# EAGLE design BlaszczakPI (EAGLE 7.7.0)
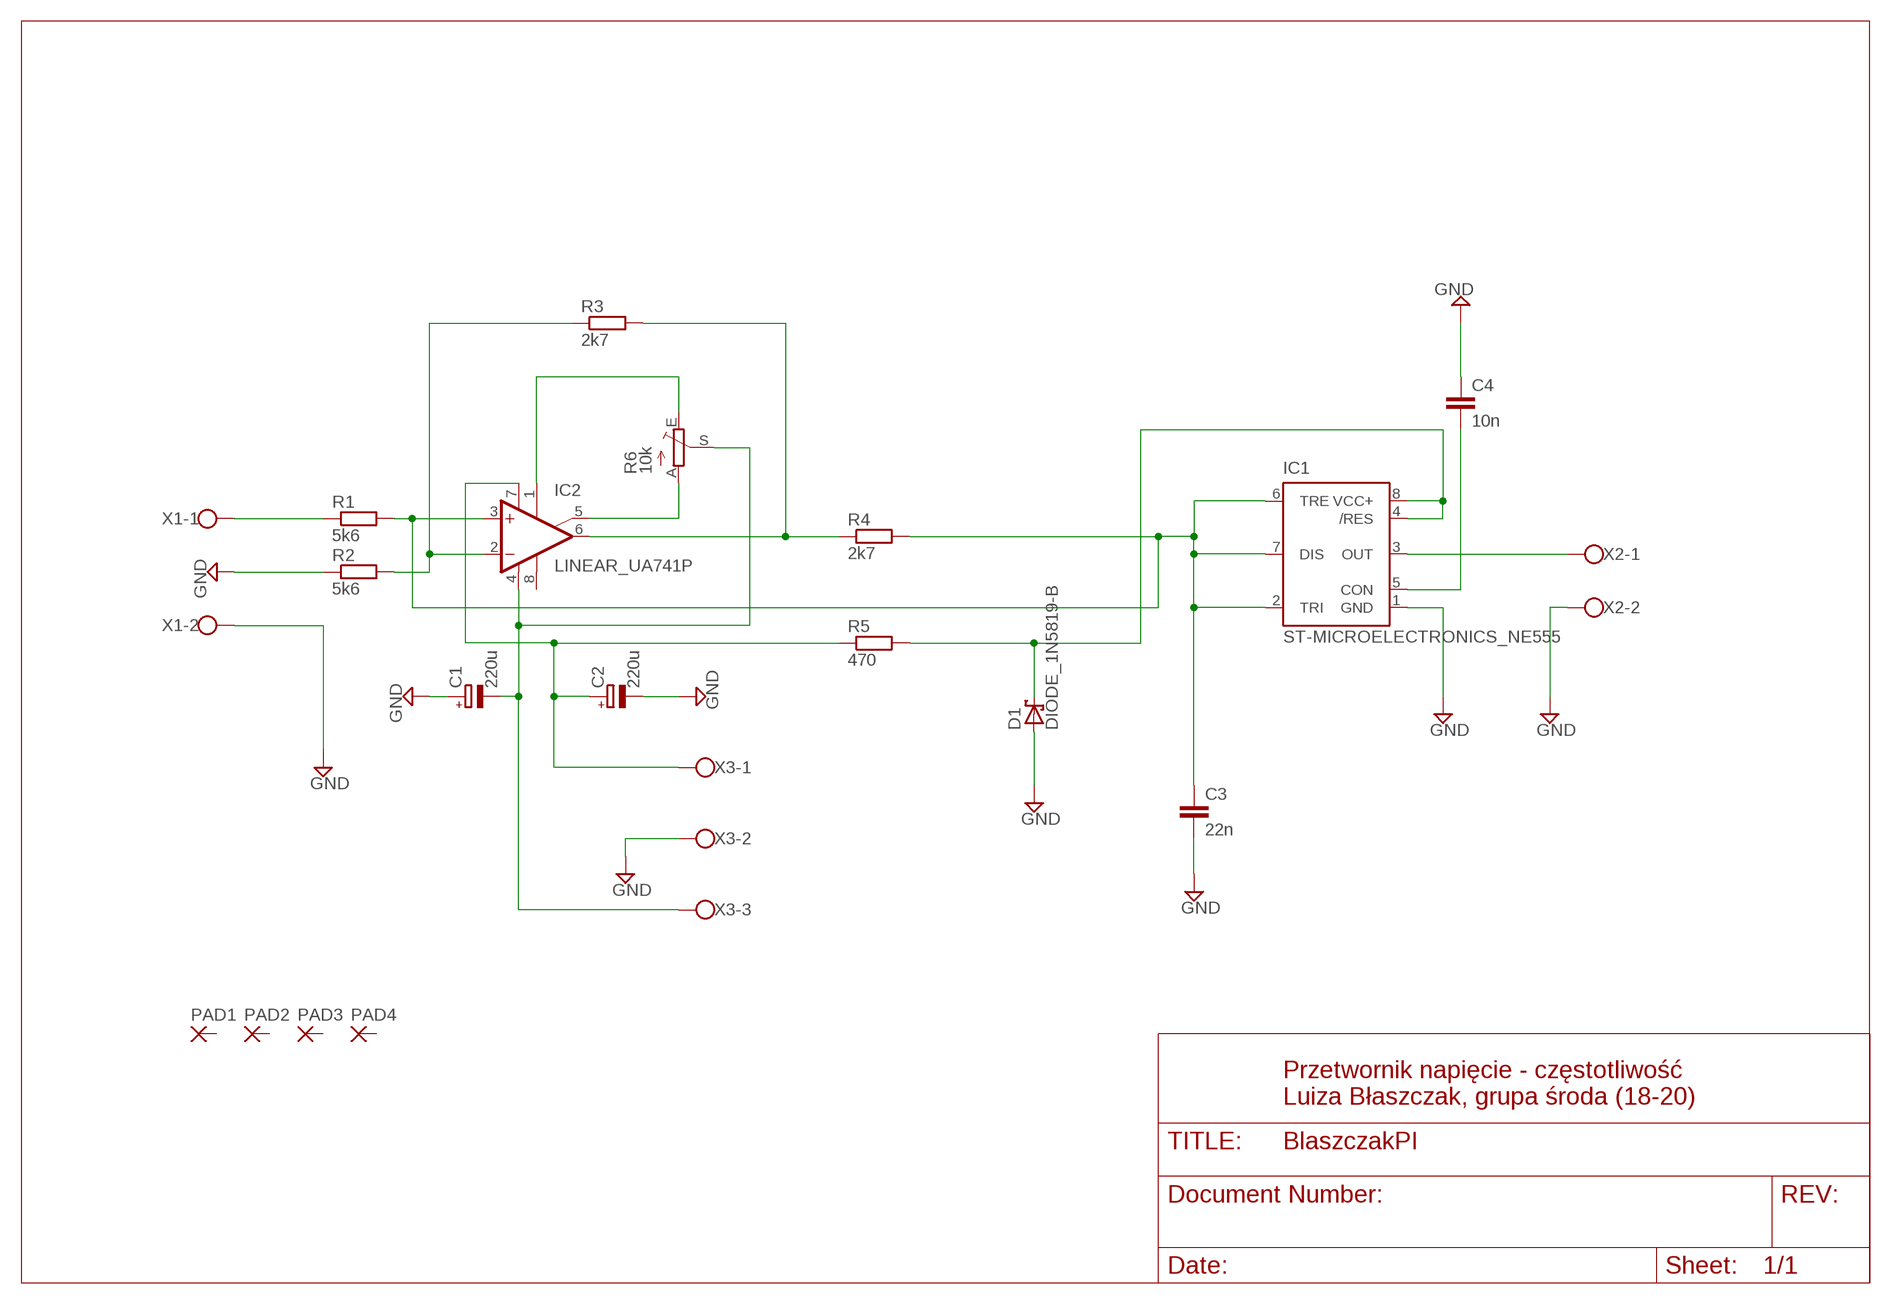
[diagram p0: schematic, sheet 1]

## Parts
C1  220u  RCL_CPOL-EUE2.5-7  [RCL_E2,5-7]
C2  220u  RCL_CPOL-EUE2.5-7  [RCL_E2,5-7]
C3  22n  C-EUC1206  [C1206]
C4  10n  C-EUC1206  [C1206]
D1  DIODE_1N5819-B  [DIODE_DO41-7.6]
IC1  ST-MICROELECTRONICS_NE555  [ST-MICROELECTRONICS_DIL-08]
IC2  LINEAR_UA741P  [LINEAR_DIL08]
PAD1  2,54/1,1  [2,54/1,1]
PAD2  2,54/1,1  [2,54/1,1]
PAD3  2,54/1,1  [2,54/1,1]
PAD4  2,54/1,1  [2,54/1,1]
R1  5k6  R-EU_M1206  [M1206]
R2  5k6  R-EU_M1206  [M1206]
R3  2k7  R-EU_M1206  [M1206]
R4  2k7  R-EU_M1206  [M1206]
R5  470  R-EU_M1206  [M1206]
R6  10k  POT_TRIM_EU-CA6V  [POT_CA6V]
X1  CON-WAGO-500_W237-102  [CON-WAGO-500_W237-102]
X2  CON-WAGO-500_W237-102  [CON-WAGO-500_W237-102]
X3  CON-WAGO-500_W237-103  [CON-WAGO-500_W237-103]

## Nets
GND: C1.+ C2.- C3.2 C4.1 D1.A IC1.1(GND) R2.1 X1.2 X2.2 X3.2
N$1: R1.1 X1.1
N$3: IC2.2(-IN) R2.2 R3.1
N$4: C1.- IC2.4(V-) R6.S X3.3
N$5: C2.+ IC2.7(V+) R5.1 X3.1
N$6: IC2.1(ON1) R6.E
N$7: IC2.5(ON2) R6.A
N$8: IC2.6(OUT) R3.2 R4.1
N$9: D1.C IC1.4(/RES) IC1.8(VCC+) R5.2
N$11: C4.2 IC1.5(CON)
N$12: IC1.3(OUT) X2.1
R80: C3.1 IC1.2(TRI) IC1.6(TRE) IC1.7(DIS) IC2.3(+IN) R1.2 R4.2
Unconnected: IC2.8(OPT) PAD1.1(P) PAD2.1(P) PAD3.1(P) PAD4.1(P)

## Notes on the sheet
- Przetwornik napięcie - częstotliwość 
  Luiza Błaszczak, grupa środa (18-20)

## Library data of the parts
C1 C2 = Blaszczak:RCL_CPOL-EU: POLARIZED CAPACITOR, European symbol
C3 C4 = rcl:C-EU: CAPACITOR, European symbol
D1 = Blaszczak:DIODE_1N581*: 1.0A SCHOTTKY BARRIER RECTIFIER Source: http://www.diodes.com/datasheets/ds23001.pdf
IC1 = Blaszczak:ST-MICROELECTRONICS_NE555: General purpose bipolar Timer; MF: Arrow Electronics; MPN: NE555N; OC_FARNELL: 1467742; OC_NEWARK: 89K1486
IC2 = Blaszczak:LINEAR_*741: OP AMP
PAD1-PAD4 = wirepad:2,54/1,1: THROUGH-HOLE PAD
R1-R5 = rcl:R-EU_: RESISTOR, European symbol
R6 = Blaszczak:POT_TRIM_EU-: POTENTIOMETER
X1 X2 = Blaszczak:CON-WAGO-500_W237-102: WAGO SCREW CLAMP; MPN: 237-102; OC_FARNELL: unknown; OC_NEWARK: 70K9898
X3 = Blaszczak:CON-WAGO-500_W237-103: WAGO SCREW CLAMP; MPN: 237-103; OC_FARNELL: unknown; OC_NEWARK: 18M7116

## Board
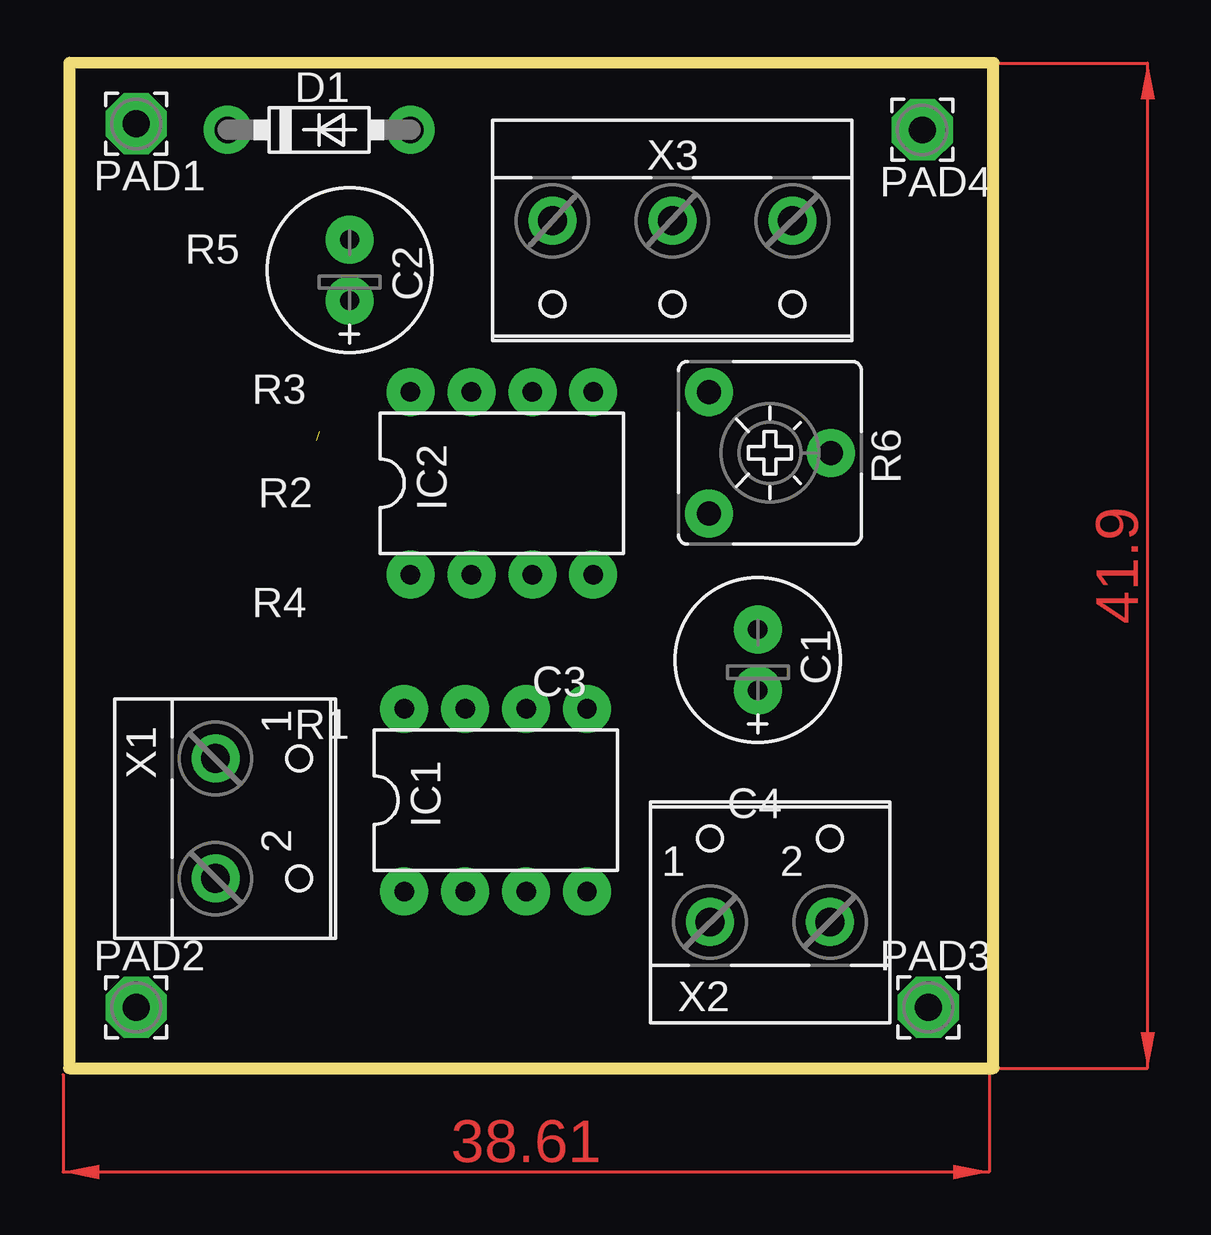
[diagram p1: board, top side]
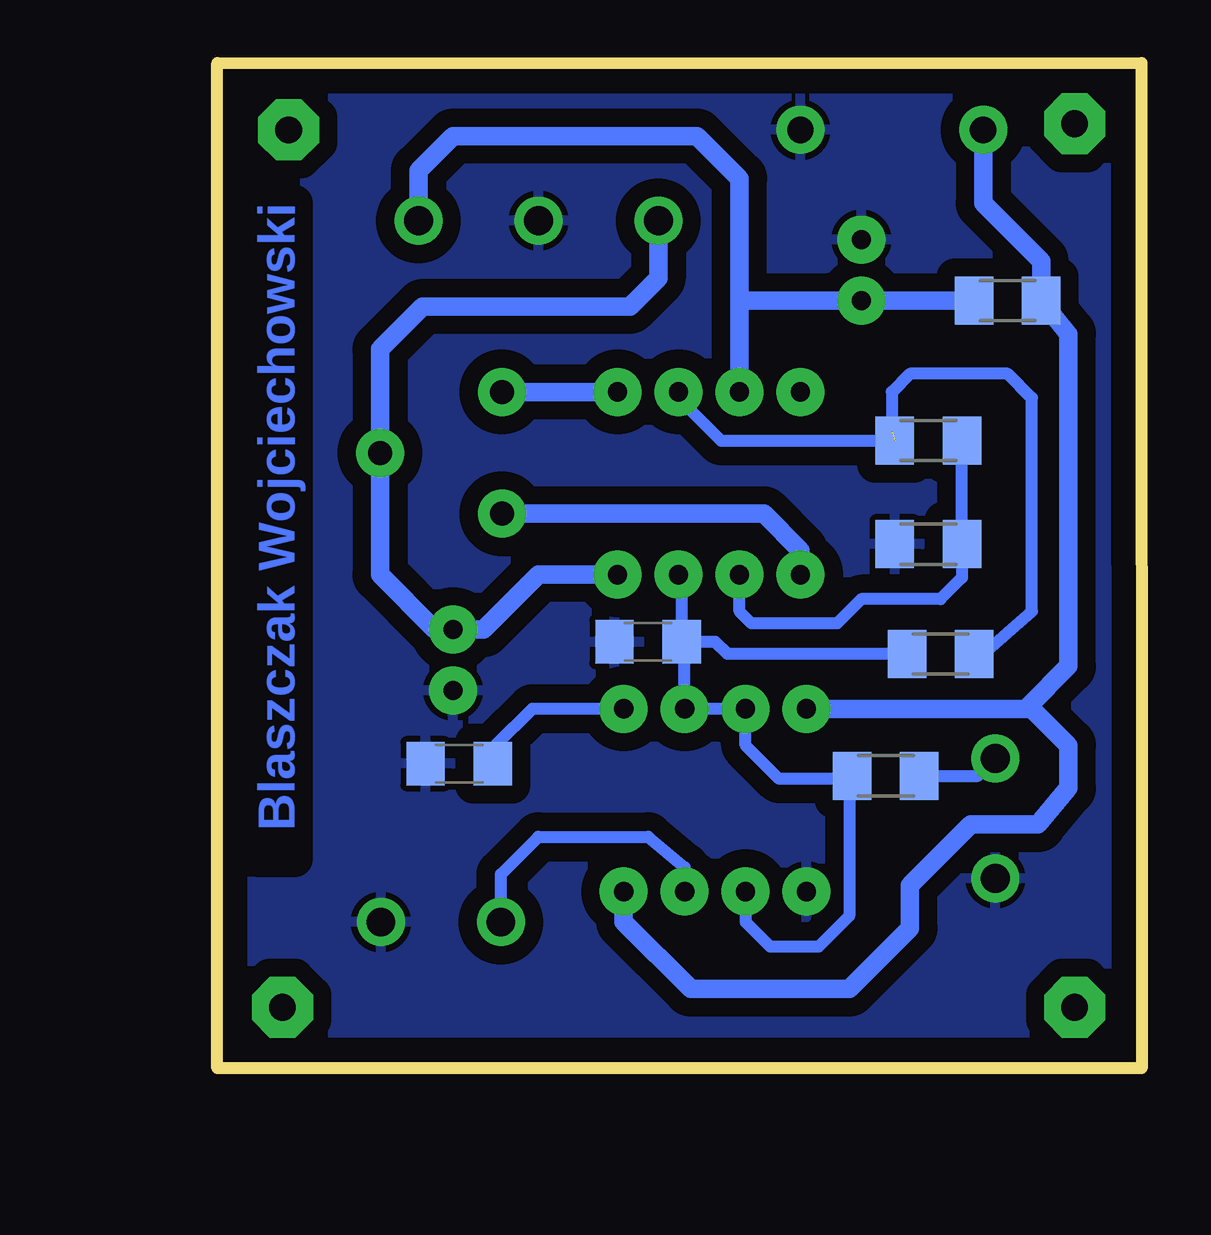
[diagram p2: board, bottom side, seen from below]

Size 38.53 x 41.91 mm. Coordinates in mm from the lower left corner, seen from the top.
Outline: 0,0 38.53,0 38.53,41.9 0.01,41.91 0,0
Copper layers (1*16): Top 0.035mm / dielectric 1.5mm / Bottom 0.035mm
Design rules "default": minimum track width 10mil, minimum drill 24mil, track to track 8mil, track to pad 8mil, pad to pad 8mil, via to via 8mil, smd to smd 8mil, copper to edge 40mil, drill to drill 8mil, minimum pad ring 10mil, minimum via ring 8mil, stop-mask expansion 4mil, vias tented up to drill 0mil, thermal gap 10mil

### Footprints (pad centres in the part's own frame; a part is rotated, then mirrored left to right if it is on the bottom)
RCL_E2,5-7 = drill 0.8 pad 2: + -1.27,0; - 1.27,0
C1206 = smd 1.6 x 1.8: 1 -1.4,0; 2 1.4,0
DIODE_DO41-7.6 = drill 1.1 pad 2: A 3.81,0; C -3.81,0
ST-MICROELECTRONICS_DIL-08 = drill 0.8 pad 2: 1 -3.81,-3.81; 2 -1.27,-3.81; 3 1.27,-3.81; 4 3.81,-3.81; 5 3.81,3.81; 6 1.27,3.81; 7 -1.27,3.81; 8 -3.81,3.81
LINEAR_DIL08 = drill 0.8 pad 2: 1 -3.81,-3.81; 2 -1.27,-3.81; 3 1.27,-3.81; 4 3.81,-3.81; 5 3.81,3.81; 6 1.27,3.81; 7 -1.27,3.81; 8 -3.81,3.81
2,54/1,1 = drill 1.118 pad 2.54 octagon: 1 0,0
M1206 = smd 1.6 x 2: 1 -1.4,0; 2 1.4,0
POT_CA6V = drill 1 pad 2: A -2.54,-2.54; E 2.54,-2.54; S 0,2.54
CON-WAGO-500_W237-102 = drill 1.2 pad 2: 1 -2.5,-1.27; 2 2.5,-1.27
CON-WAGO-500_W237-103 = drill 1.2 pad 2: 1 -5,-1.29; 2 0,-1.29; 3 5,-1.29

### Placement (x,y rotation side)
C1  28.7,17.02 90 top
C2  11.68,33.27 90 top
C3  20.57,17.78 180 bottom
C4  28.45,12.7 0 bottom
D1  10.41,39.12 0 top
IC1  17.78,11.18 0 top
IC2  18.03,24.38 0 top
PAD1  2.79,39.37 0 top
PAD2  2.79,2.54 0 top
PAD3  35.81,2.54 0 top
PAD4  35.56,39.12 0 top
R1  10.67,12.19 180 bottom
R2  8.89,21.84 0 bottom
R3  8.89,26.16 180 bottom
R4  8.38,17.27 180 bottom
R5  5.59,32 0 bottom
R6  29.21,25.65 270 top
X1  7.37,10.41 270 top
X2  29.21,7.37 0 top
X3  25.15,34.04 180 top

### Tracks (layer width: path | path; a pad name or v marks a point on that pad's centre or on a via)
GND
  pour Bottom (isolate 0.762): -0.25,-0.25 38.35,-0.25 38.35,41.66 -0.25,41.91
N$1
  Bottom 0.508: R1.1 6.82,12.19 X1.1
N$3
  Bottom 0.508: R3.1 R2.2 7.49,20.45 8.38,19.56 11.68,19.56 12.7,18.54 16.26,18.54 16.76,19.05 IC2.2
N$4
  Bottom 0.762: IC2.4 25.15,20.57 27.43,18.29 C1.- 29.46,18.29 31.75,20.57 R6.S 31.75,29.97 29.97,31.75 21.34,31.75 20.15,32.94 X3.3
N$5
  Bottom 0.762: IC2.7 16.76,32 | 16.76,32 16.76,37.08 18.54,38.86 28.7,38.86 30.15,37.42 X3.1 | 16.76,32 12.95,32 C2.+ R5.1
N$6
  Bottom 0.762: IC2.1 14.22,21.59 15.75,23.11 R6.E
N$7
  Bottom 0.762: IC2.5 R6.A
N$8  (1 unrouted)
  Bottom 0.508: R4.1 6.6,17.27 4.57,19.05 4.57,27.94 5.59,28.96 9.65,28.96 10.41,28.19 10.41,26.54 | R3.2 17.53,26.16 19.3,27.94 IC2.6
N$9
  Bottom 0.762: 4.7,15.11 3.05,16.76 3.05,30.61 R5.2 4.19,33.65 6.6,36.07 D1.C | 4.7,15.11 3.05,13.46 3.05,11.68 4.32,10.16 7.11,10.16 9.65,7.62 9.65,5.84 12.19,3.3 18.8,3.3 21.59,6.1 IC1.4 | IC1.8 4.83,14.99 4.7,15.11
N$11
  Bottom 0.508: IC1.5 25.4,14.99 26.92,13.46 26.92,12.82 C4.2
N$12
  Bottom 0.508: X2.1 26.71,8.09 25.15,9.65 20.57,9.65 19.05,8.38 IC1.3
R80
  Bottom 0.508: 12.19,12.07 R1.2 | 19.05,17.65 C3.1 | 9.91,17.4 R4.2 17.27,17.27 17.78,17.78 C3.1 | C3.1 19.3,17.91 19.3,17.53 19.05,17.27 | IC2.3 19.17,20.83 C3.1 | IC1.2 16.51,6.1 15.49,5.08 13.46,5.08 12.19,6.35 12.19,12.07 | C3.1 19.05,17.66 IC1.6 IC1.7 16.51,13.46 15.12,12.07 12.19,12.07
(copper drawn outside any net)
  shapes: Top area x2

### Text on the board
Bottom: Blaszczak Wojciechowski